# EasyEDA schematic SCH_RIGHT_2025-11-04.json
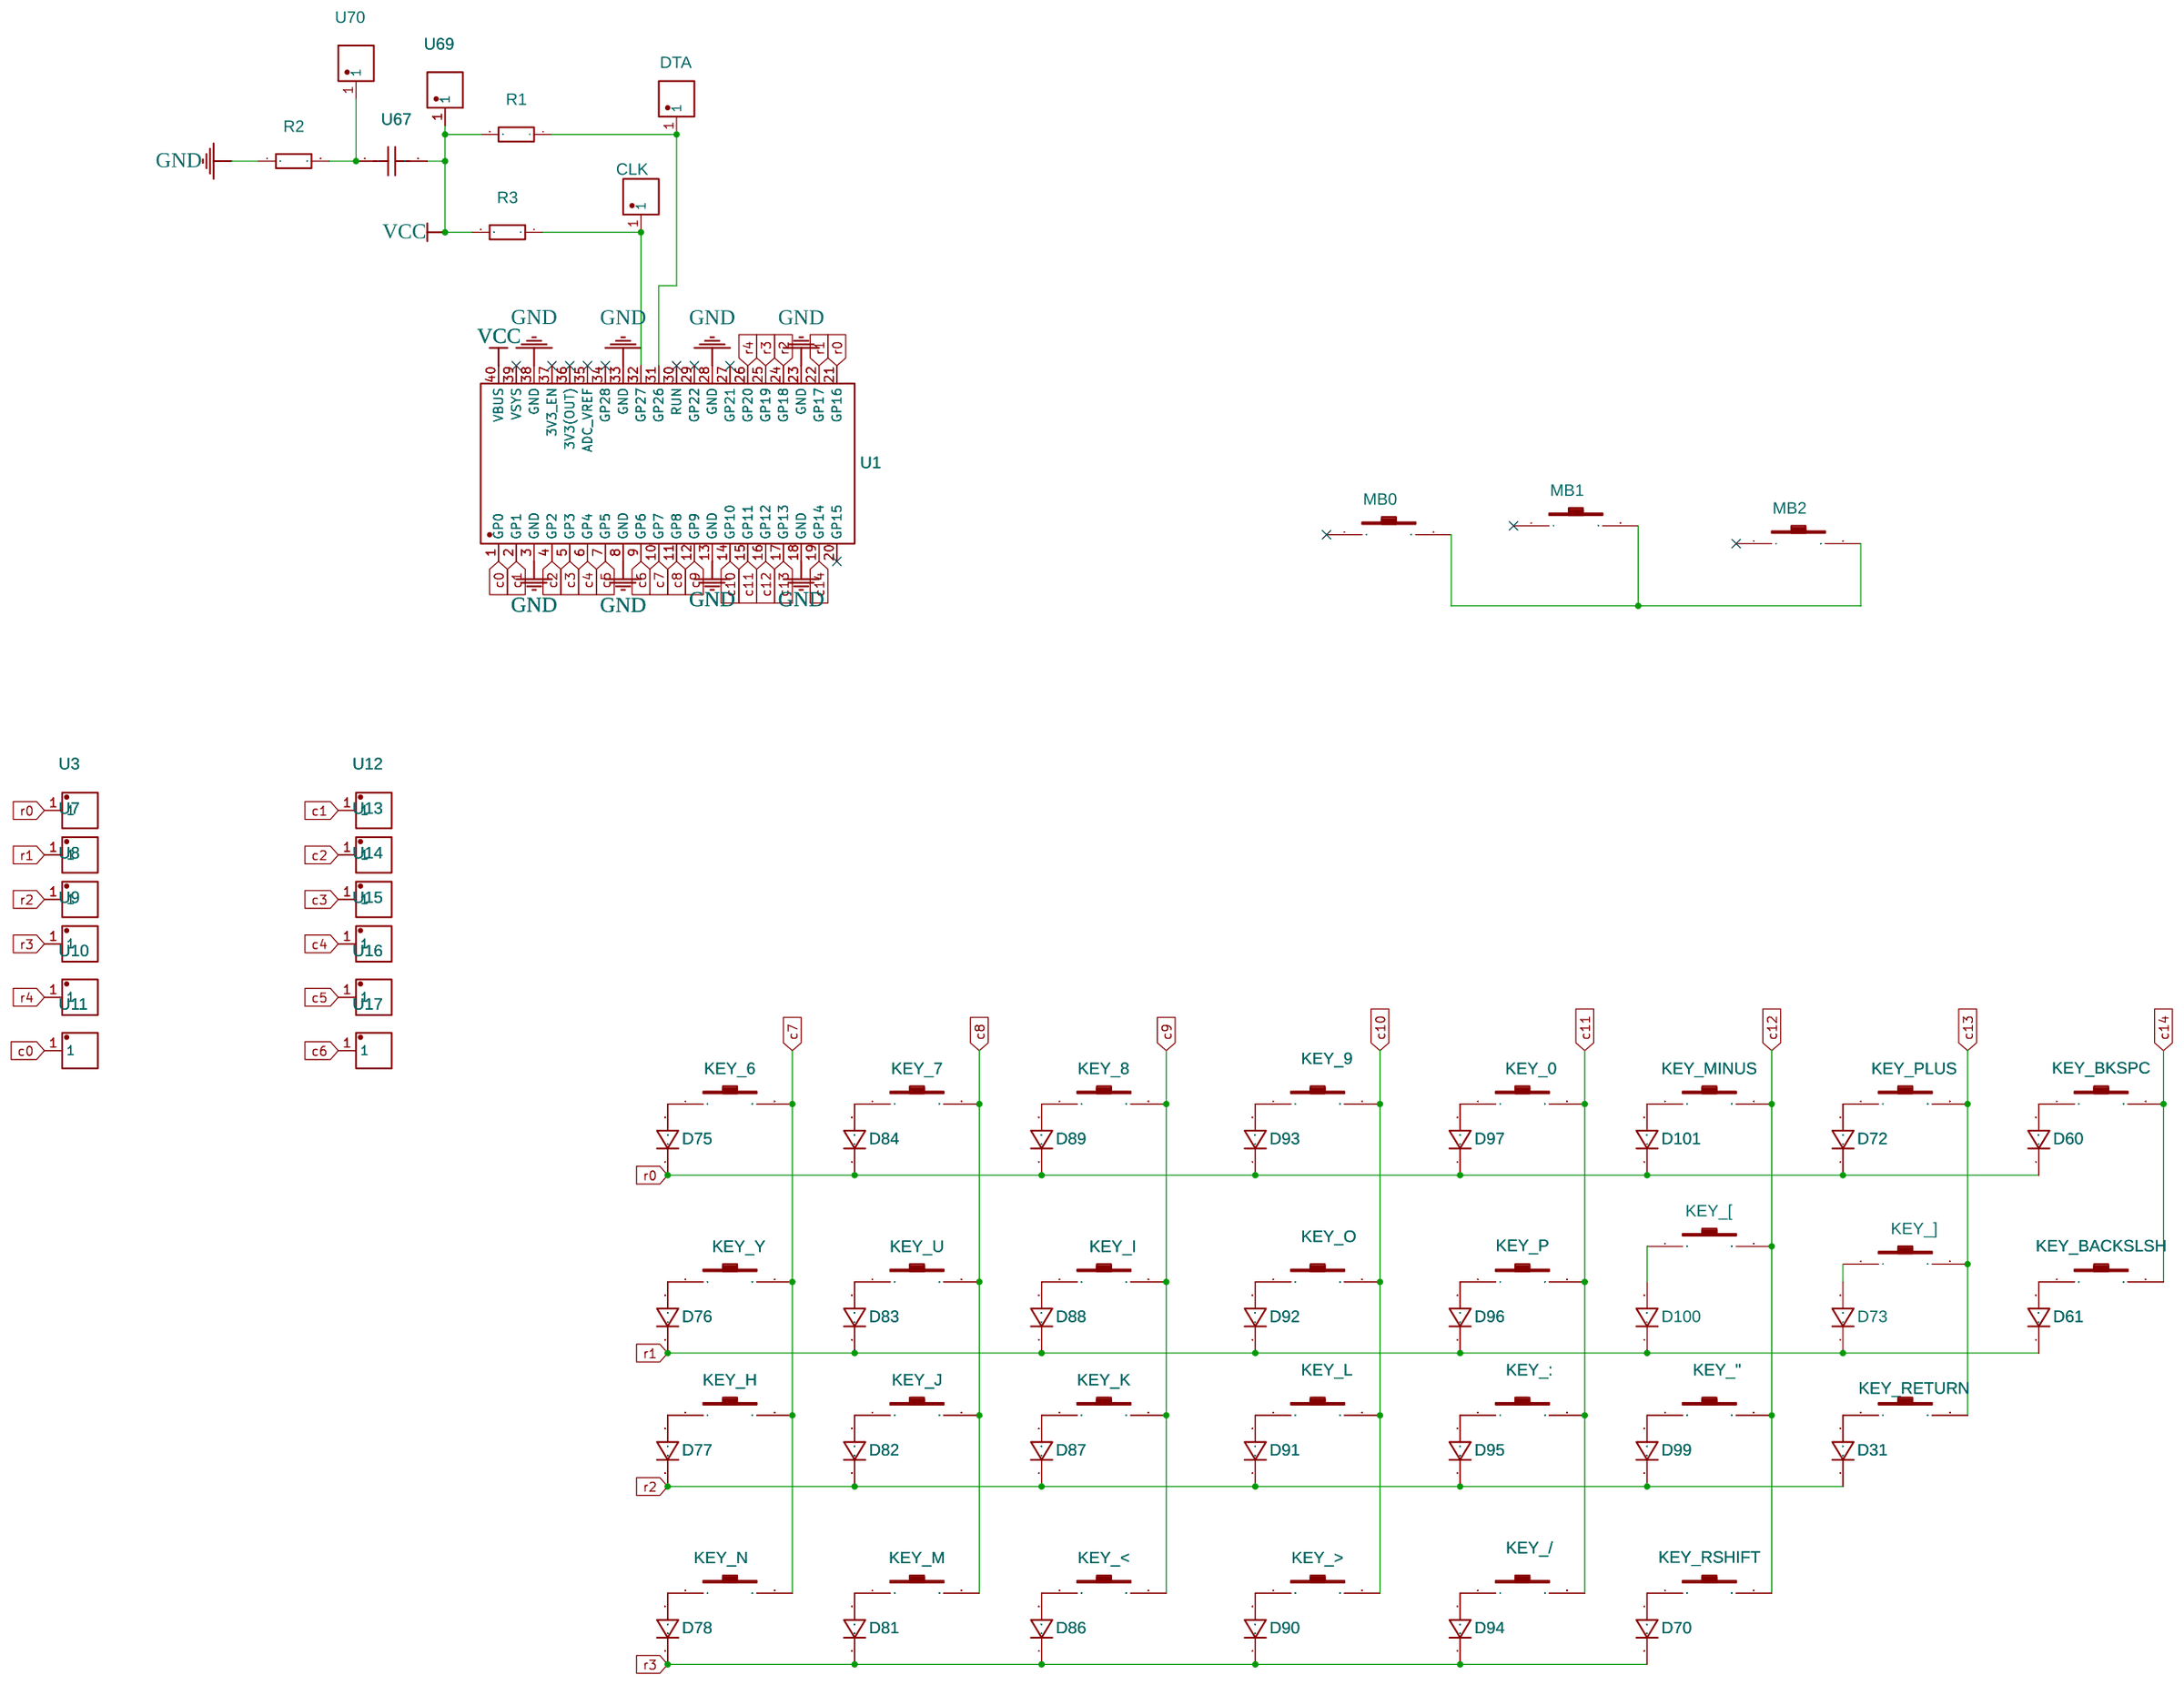
[diagram p0: schematic sheet]

## Parts
CLK  CLK  [TH_POGOPIN]
D31  1N4148W  [1N4148W]
D60  1N4148W  [1N4148W]
D61  1N4148W  [1N4148W]
D70  1N4148W  [1N4148W]
D72  1N4148W  [1N4148W]
D73  1N4148W  [1N4148W]
D75  1N4148W  [1N4148W]
D76  1N4148W  [1N4148W]
D77  1N4148W  [1N4148W]
D78  1N4148W  [1N4148W]
D81  1N4148W  [1N4148W]
D82  1N4148W  [1N4148W]
D83  1N4148W  [1N4148W]
D84  1N4148W  [1N4148W]
D86  1N4148W  [1N4148W]
D87  1N4148W  [1N4148W]
D88  1N4148W  [1N4148W]
D89  1N4148W  [1N4148W]
D90  1N4148W  [1N4148W]
D91  1N4148W  [1N4148W]
D92  1N4148W  [1N4148W]
D93  1N4148W  [1N4148W]
D94  1N4148W  [1N4148W]
D95  1N4148W  [1N4148W]
D96  1N4148W  [1N4148W]
D97  1N4148W  [1N4148W]
D99  1N4148W  [1N4148W]
D100  1N4148W  [1N4148W]
D101  1N4148W  [1N4148W]
DTA  DTA  [TH_POGOPIN]
KEY_0  Outemu Switch  [KEYBOARD_SWITCH]
KEY_6  Outemu Switch  [KEYBOARD_SWITCH]
KEY_7  Outemu Switch  [KEYBOARD_SWITCH]
KEY_8  Outemu Switch  [KEYBOARD_SWITCH]
KEY_9  Outemu Switch  [KEYBOARD_SWITCH]
KEY_"  Outemu Switch  [KEYBOARD_SWITCH]
KEY_/  Outemu Switch  [KEYBOARD_SWITCH]
KEY_:  Outemu Switch  [KEYBOARD_SWITCH]
KEY_<  Outemu Switch  [KEYBOARD_SWITCH]
KEY_>  Outemu Switch  [KEYBOARD_SWITCH]
KEY_[  Outemu Switch  [KEYBOARD_SWITCH]
KEY_]  Outemu Switch  [KEYBOARD_SWITCH]
KEY_BACKSLSH  Outemu Switch  [KEYBOARD_SWITCH]
KEY_BKSPC  Outemu Switch  [KEYBOARD_SWITCH]
KEY_H  Outemu Switch  [KEYBOARD_SWITCH]
KEY_I  Outemu Switch  [KEYBOARD_SWITCH]
KEY_J  Outemu Switch  [KEYBOARD_SWITCH]
KEY_K  Outemu Switch  [KEYBOARD_SWITCH]
KEY_L  Outemu Switch  [KEYBOARD_SWITCH]
KEY_M  Outemu Switch  [KEYBOARD_SWITCH]
KEY_MINUS  Outemu Switch  [KEYBOARD_SWITCH]
KEY_N  Outemu Switch  [KEYBOARD_SWITCH]
KEY_O  Outemu Switch  [KEYBOARD_SWITCH]
KEY_P  Outemu Switch  [KEYBOARD_SWITCH]
KEY_PLUS  Outemu Switch  [KEYBOARD_SWITCH]
KEY_RETURN  Outemu Switch  [KEYBOARD_SWITCH]
KEY_RSHIFT  Outemu Switch  [KEYBOARD_SWITCH]
KEY_U  Outemu Switch  [KEYBOARD_SWITCH]
KEY_Y  Outemu Switch  [KEYBOARD_SWITCH]
MB0  Outemu Switch  [KEYBOARD_SWITCH]
MB1  Outemu Switch  [KEYBOARD_SWITCH]
MB2  Outemu Switch  [KEYBOARD_SWITCH]
R1  4.7kΩ  [RES-TH_BD2.3-L6.5-P10.50-D0.5]
R2  110kΩ  [RES-TH_BD2.3-L6.5-P10.50-D0.5]
R3  4.7kΩ  [RES-TH_BD2.3-L6.5-P10.50-D0.5]
U1  RP2040-PLUS  [LCC-40_L51.0-W21.0-P2.54-BL_RP2040-BASED]
U3  54102-T06-00  [HDR-TH_1P-P2.54-V-M]
U7  54102-T06-00  [HDR-TH_1P-P2.54-V-M]
U8  54102-T06-00  [HDR-TH_1P-P2.54-V-M]
U9  54102-T06-00  [HDR-TH_1P-P2.54-V-M]
U10  54102-T06-00  [HDR-TH_1P-P2.54-V-M]
U11  54102-T06-00  [HDR-TH_1P-P2.54-V-M]
U12  54102-T06-00  [HDR-TH_1P-P2.54-V-M]
U13  54102-T06-00  [HDR-TH_1P-P2.54-V-M]
U14  54102-T06-00  [HDR-TH_1P-P2.54-V-M]
U15  54102-T06-00  [HDR-TH_1P-P2.54-V-M]
U16  54102-T06-00  [HDR-TH_1P-P2.54-V-M]
U17  54102-T06-00  [HDR-TH_1P-P2.54-V-M]
U67  2,2mF  [CAP-TH_L7.0-W5.0-P5.00-D1.2]
U69  VCC  [TH_POGOPIN]
U70  RST  [TH_POGOPIN]

## Library data of the parts
CLK DTA U69 U70 = POGOPIN 弹簧顶针(9.0H-2.0T直通加粗): Contributor: LCSC; Supplier: LCSC; Supplier Part: C9900001338; Manufacturer: null; Manufacturer Part: pogopin 弹簧顶针(9.0H-2.0T直通加粗); JLCPCB Part Class: Extended Part
D31 D60 D61 D70 D72 D73 D75-D78 D81-D84 D86-D97 D99-D101 = 1N4148W: Manufacturer: SMC Diode Solutions; Supplier: Digi-Key; Supplier Part: 1655-1N4148WCT-ND; link: https://www.digikey.ca/en/products/detail/smc-diode-solutions/1N4148W/6022450; Contributor: Optech
KEY_0 KEY_6-KEY_9 KEY_" KEY_/ KEY_: KEY_< KEY_> KEY_[ KEY_] KEY_BACKSLSH KEY_BKSPC KEY_H KEY_I KEY_J KEY_K KEY_L KEY_M KEY_MINUS KEY_N KEY_O KEY_P KEY_PLUS KEY_RETURN KEY_RSHIFT KEY_U KEY_Y MB0-MB2 = Outemu Switch: Contributor: michal.licht1806
R1-R3 = CF1/4W-110KΩ±5% T52: Contributor: LCSC; Supplier: LCSC; Supplier Part: C120104; Manufacturer: CCO(千志电子); JLCPCB Part Class: Extended Part
U1 = RP2040-PLUS: Supplier: LCSC; Supplier Part: C5374681; Manufacturer: Waveshare(微雪电子); Manufacturer Part: RP2040-Plus; JLCPCB Part Class: Extended Part; link: https://lcsc.com/eda_search?q=C5374681&%26type=1&ref=editor
U3 U7-U17 = 54102-T06-00: Contributor: LCSC; Supplier: LCSC; Supplier Part: C213182; Manufacturer: Amphenol
U67 = B32529C1684K000: Supplier: LCSC; Manufacturer: TDK; Supplier Part: C117683; JLCPCB Part Class: Extended Part

## Nets
GND: R2.1 U1.3(GND) U1.8(GND) U1.13(GND) U1.18(GND) U1.23(GND) U1.28(GND) U1.33(GND) U1.38(GND)
VCC: R1.2 R3.2 U1.40(VBUS) U67.2 U69.1
c0: U1.1(GP0) U11.1
c1: U1.2(GP1) U12.1
c2: U1.4(GP2) U13.1
c3: U1.5(GP3) U14.1
c4: U1.6(GP4) U15.1
c5: U1.7(GP5) U16.1
c6: U1.9(GP6) U17.1
c7: KEY_6.2 KEY_H.2 KEY_N.2 KEY_Y.2 U1.10(GP7)
c8: KEY_7.2 KEY_J.2 KEY_M.2 KEY_U.2 U1.11(GP8)
c9: KEY_8.2 KEY_<.2 KEY_I.2 KEY_K.2 U1.12(GP9)
c10: KEY_9.2 KEY_>.2 KEY_L.2 KEY_O.2 U1.14(GP10)
c11: KEY_0.2 KEY_/.2 KEY_:.2 KEY_P.2 U1.15(GP11)
c12: KEY_".2 KEY_[.2 KEY_MINUS.2 KEY_RSHIFT.2 U1.16(GP12)
c13: KEY_].2 KEY_PLUS.2 KEY_RETURN.2 U1.17(GP13)
c14: KEY_BACKSLSH.2 KEY_BKSPC.2 U1.19(GP14)
r0: D60.1 D72.1 D75.1 D84.1 D89.1 D93.1 D97.1 D101.1 U1.21(GP16) U3.1
r1: D61.1 D73.1 D76.1 D83.1 D88.1 D92.1 D96.1 D100.1 U1.22(GP17) U7.1
r2: D31.1 D77.1 D82.1 D87.1 D91.1 D95.1 D99.1 U1.24(GP18) U8.1
r3: D70.1 D78.1 D81.1 D86.1 D90.1 D94.1 U1.25(GP19) U9.1
r4: U1.26(GP20) U10.1
Net-(CLK-1): CLK.1 R3.1 U1.32(GP27)
Net-(D31-2): D31.2 KEY_RETURN.1
Net-(D60-2): D60.2 KEY_BKSPC.1
Net-(D61-2): D61.2 KEY_BACKSLSH.1
Net-(D70-2): D70.2 KEY_RSHIFT.1
Net-(D72-2): D72.2 KEY_PLUS.1
Net-(D73-2): D73.2 KEY_].1
Net-(D75-2): D75.2 KEY_6.1
Net-(D76-2): D76.2 KEY_Y.1
Net-(D77-2): D77.2 KEY_H.1
Net-(D78-2): D78.2 KEY_N.1
Net-(D81-2): D81.2 KEY_M.1
Net-(D82-2): D82.2 KEY_J.1
Net-(D83-2): D83.2 KEY_U.1
Net-(D84-2): D84.2 KEY_7.1
Net-(D86-2): D86.2 KEY_<.1
Net-(D87-2): D87.2 KEY_K.1
Net-(D88-2): D88.2 KEY_I.1
Net-(D89-2): D89.2 KEY_8.1
Net-(D90-2): D90.2 KEY_>.1
Net-(D91-2): D91.2 KEY_L.1
Net-(D92-2): D92.2 KEY_O.1
Net-(D93-2): D93.2 KEY_9.1
Net-(D94-2): D94.2 KEY_/.1
Net-(D95-2): D95.2 KEY_:.1
Net-(D96-2): D96.2 KEY_P.1
Net-(D97-2): D97.2 KEY_0.1
Net-(D99-2): D99.2 KEY_".1
Net-(D100-2): D100.2 KEY_[.1
Net-(D101-2): D101.2 KEY_MINUS.1
Net-(DTA-1): DTA.1 R1.1 U1.31(GP26)
Net-(MB0-2): MB0.2 MB1.2 MB2.2
Net-(R2-2): R2.2 U67.1 U70.1

Not connected (* = marked no-connect by the designer): MB0 1*; MB1 1*; MB2 1*; U1 20(GP15)* 27(GP21)* 29(GP22)* 30(RUN)* 34(GP28)* 35(ADC_VREF)* 36(3V3(OUT))* 37(3V3_EN)* 39(VSYS)*
